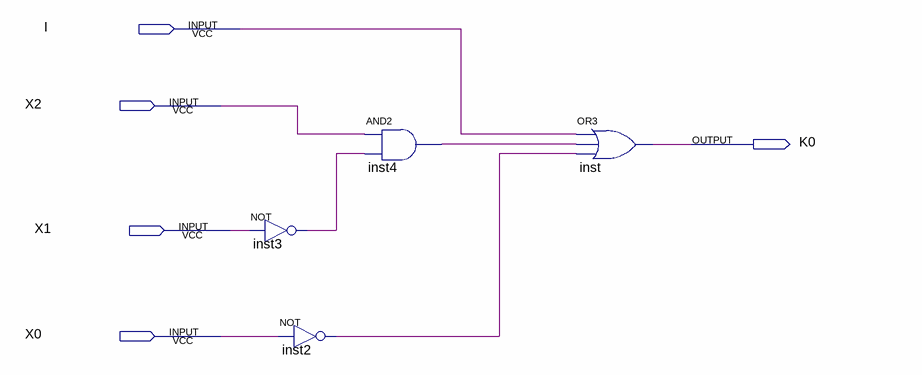
[diagram p0: schematic sheet]
// Quartus schematic K0.bdf as structural Verilog: 4 symbols, 5 pins
module K0 (
  input  I,
  input  X2,
  input  X1,
  input  X0,
  output K0
);

  wire inst2_out, inst3_out, inst4_out;

  not inst3 (inst3_out, X1);
  not inst2 (inst2_out, X0);
  and inst4 (inst4_out, X2, inst3_out);
  or inst (K0, I, inst4_out, inst2_out);
endmodule
